# EAGLE schematic Habit-Reformer (EAGLE 7.3.0)
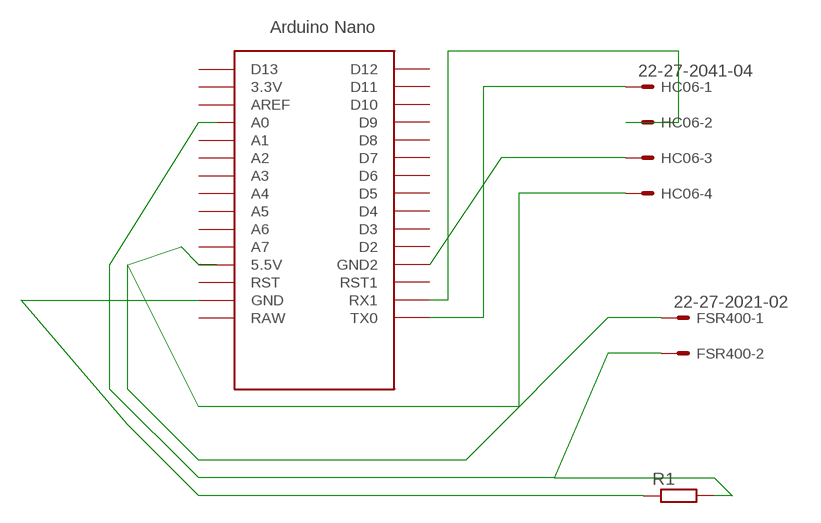
[diagram p0: schematic, sheet 1]

## Parts
FSR400  22-27-2021-02  [6410-02]
HC06  22-27-2041-04  [6410-04]
R1  R-EU_0204/7  [0204/7]
U$1  NANO  [NANO]

## Nets
N$1: HC06.1 U$1.TX0
N$2: HC06.2 U$1.RX1
N$3: HC06.3 U$1.GND1(GND2)
N$4: FSR400.1 HC06.4 U$1.5V(5.5V)
N$5: FSR400.2 R1.2 U$1.A0
N$6: R1.1 U$1.GND
Unconnected: U$1.3.3V U$1.A1 U$1.A2 U$1.A3 U$1.A4 U$1.A5 U$1.A6 U$1.A7 U$1.AREF U$1.D2 U$1.D3 U$1.D4 U$1.D5 U$1.D6 U$1.D7 U$1.D8 U$1.D9 U$1.D10 U$1.D11 U$1.D12 U$1.D13 U$1.ICSP1 U$1.ICSP2 U$1.ICSP3 U$1.ICSP4 U$1.ICSP5 U$1.ICSP6 U$1.RAW U$1.RST U$1.RST1

## Library data of the parts
FSR400 = con-molex:22-?-02: CONNECTOR wire to board 2.54 mm (.1 inch) pitch header; OC_FARNELL: unknown; OC_NEWARK: unknown
HC06 = con-molex:22-?-04: CONNECTOR wire to board 2.54 mm (.1 inch) pitch header; OC_FARNELL: unknown; OC_NEWARK: unknown
R1 = resistor:R-EU_: RESISTOR, European symbol
U$1 = Arduino-clone:NANO: Arduino Nano